# EAGLE design SmartSwitchController (EAGLE 6.4)
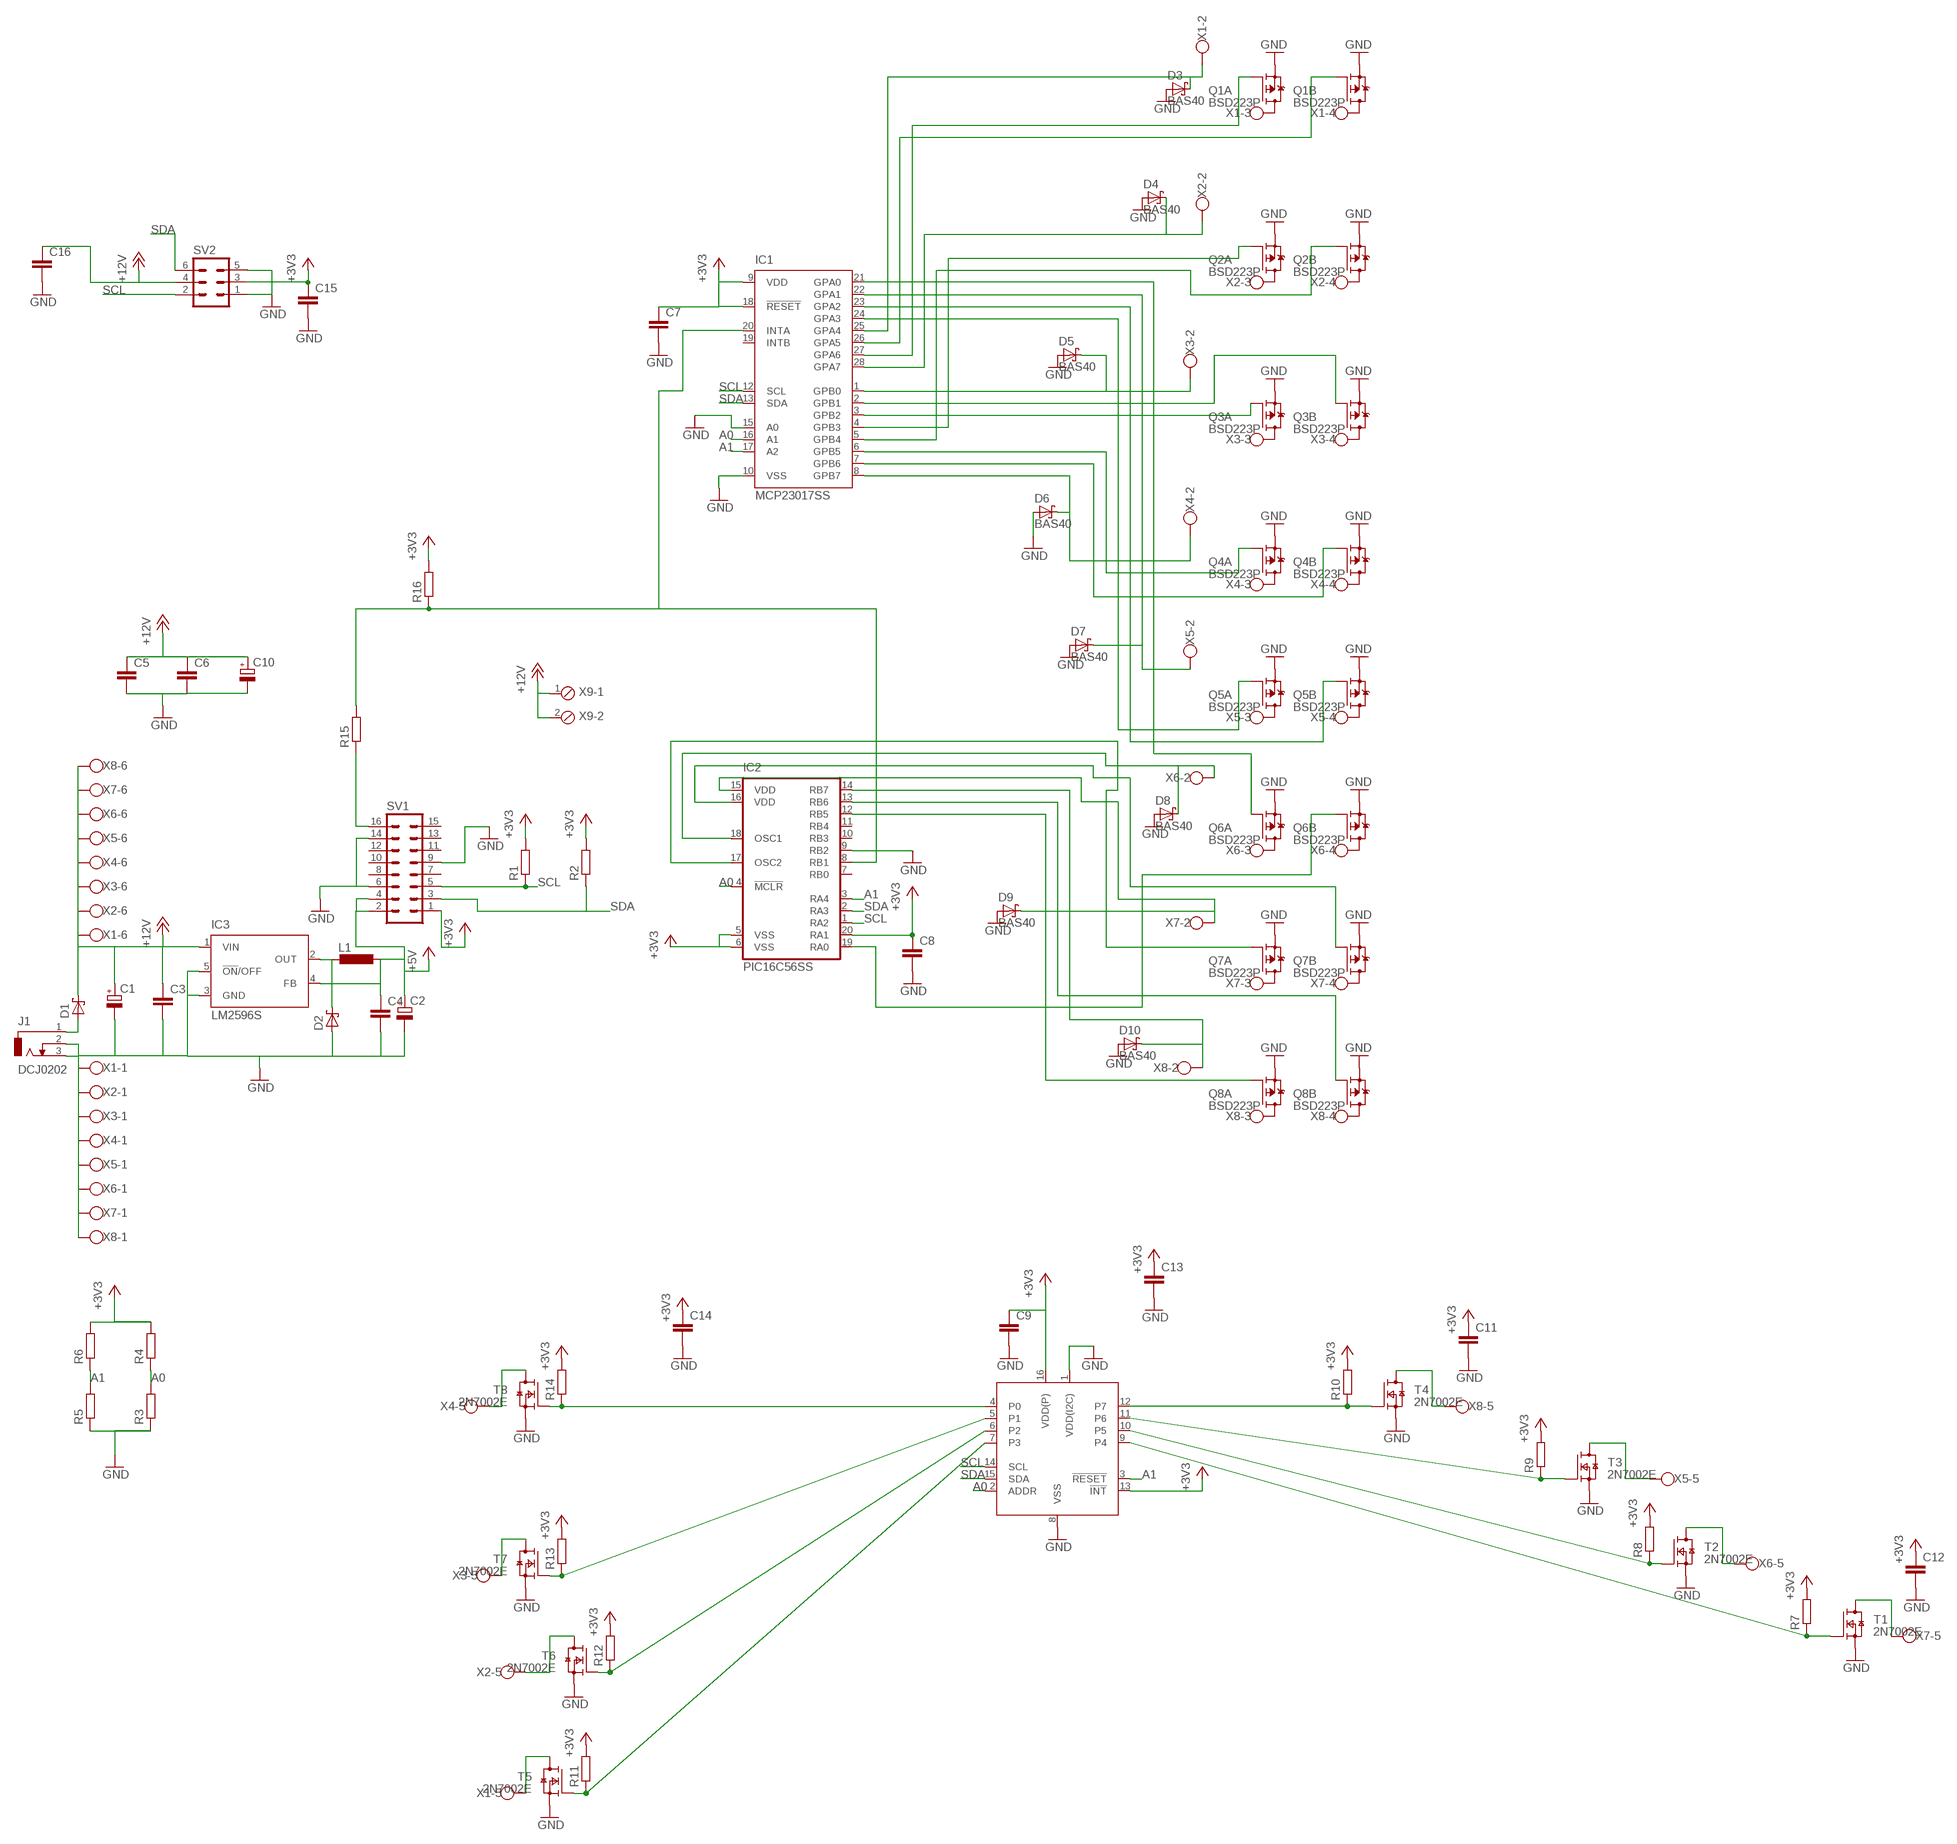
[diagram p0: schematic, sheet 1]

## Parts
C1  CPOL-EUUD-6,3X7,7  [UD-6,3X7,7_NICHICON]
C2  CPOL-EUUD-10X10  [UD-10X10_NICHICON]
C3  C-EUC0603  [C0603]
C4  C-EUC0603  [C0603]
C5  C-EUC0603  [C0603]
C6  C-EUC0805  [C0805]
C7  C-EUC0603  [C0603]
C8  C-EUC0603  [C0603]
C9  C-EUC0603  [C0603]
C10  CPOL-EUUD-6,3X7,7  [UD-6,3X7,7_NICHICON]
C11  C-EUC0603  [C0603]
C12  C-EUC0603  [C0603]
C13  C-EUC0805  [C0805]
C14  C-EUC0805  [C0805]
C15  C-EUC0805  [C0805]
C16  C-EUC0805  [C0805]
D1  SCHOTTKY-DIODESMC  [SMC]
D2  SCHOTTKY-DIODESMC  [SMC]
D3  BAS40  [SOT23]
D4  BAS40  [SOT23]
D5  BAS40  [SOT23]
D6  BAS40  [SOT23]
D7  BAS40  [SOT23]
D8  BAS40  [SOT23]
D9  BAS40  [SOT23]
D10  BAS40  [SOT23]
IC1  MCP23017SS  [SSOP28]
IC2  PIC16C56SS  [SSOP20]
IC3  LM2596S  [TO263-5]
J1  DCJ0202  [DCJ0202]
L1  L-EUL5650M  [L5650M]
Q1  BSD223P  [SOT363_INFINEON]
Q2  BSD223P  [SOT363_INFINEON]
Q3  BSD223P  [SOT363_INFINEON]
Q4  BSD223P  [SOT363_INFINEON]
Q5  BSD223P  [SOT363_INFINEON]
Q6  BSD223P  [SOT363_INFINEON]
Q7  BSD223P  [SOT363_INFINEON]
Q8  BSD223P  [SOT363_INFINEON]
R1  R-EU_R0603  [R0603]
R2  R-EU_R0603  [R0603]
R3  R-EU_R0402  [R0402]
R4  R-EU_R0402  [R0402]
R5  R-EU_R0402  [R0402]
R6  R-EU_R0402  [R0402]
R7  R-EU_R0402  [R0402]
R8  R-EU_R0402  [R0402]
R9  R-EU_R0402  [R0402]
R10  R-EU_R0402  [R0402]
R11  R-EU_R0402  [R0402]
R12  R-EU_R0402  [R0402]
R13  R-EU_R0402  [R0402]
R14  R-EU_R0402  [R0402]
R15  R-EU_R0603  [R0603]
R16  R-EU_R0603  [R0603]
SV1  MA08-2  [MA08-2]
SV2  MA03-2  [MA03-2]
T1  2N7002E  [SOT23]
T2  2N7002E  [SOT23]
T3  2N7002E  [SOT23]
T4  2N7002E  [SOT23]
T5  2N7002E  [SOT23]
T6  2N7002E  [SOT23]
T7  2N7002E  [SOT23]
T8  2N7002E  [SOT23]
U1  PCAL6408APW  [SOT403-1]
X1  W237-6  [W237-6]
X2  W237-6  [W237-6]
X3  W237-6  [W237-6]
X4  W237-6  [W237-6]
X5  W237-6  [W237-6]
X6  W237-6  [W237-6]
X7  W237-6  [W237-6]
X8  W237-6  [W237-6]
X9  MPT2  [2POL254]

## Nets
+3V3: C7.1 C8.1 C9.1 C11.1 C12.1 C13.1 C14.1 C15.1 IC1.9(VDD) IC1.18(!RESET) IC2.5(VSS) IC2.6(VSS) IC2.20(RA1) R1.2 R2.2 R4.2 R6.2 R7.2 R8.2 R9.2 R10.2 R11.2 R12.2 R13.2 R14.2 R16.2 SV1.1 SV2.3 U1.13(!INT!) U1.16(VDD(P))
+5V: C2.+ C4.1 IC3.4(FB) L1.1 SV1.2 SV1.4
+12V: C1.+ C3.1 C5.1 C6.1 C10.+ C16.1 D1.C IC3.1(VIN) SV2.4 X1.6 X2.6 X3.6 X4.6 X5.6 X6.6 X7.6 X8.6 X9.1 X9.2
A0: IC1.16(A1) IC2.4(!MCLR) R3.2 R4.1 U1.2(ADDR)
A1: IC1.17(A2) IC2.3(RA4) R5.2 R6.1 U1.3(!RESET!)
GND: C1.- C2.- C3.2 C4.2 C5.2 C6.2 C7.2 C8.2 C9.2 C10.- C11.2 C12.2 C13.2 C14.2 C15.2 C16.2 D2.A D3.1(A) D4.1(A) D5.1(A) D6.1(A) D7.1(A) D8.1(A) D9.1(A) D10.1(A) IC1.10(VSS) IC1.15(A0) IC2.9(RB2) IC3.3(GND) IC3.5(!ON!/OFF) J1.2 J1.3 Q1.1(A:S) Q1.4(B:S) Q2.1(A:S) Q2.4(B:S) Q3.1(A:S) Q3.4(B:S) Q4.1(A:S) Q4.4(B:S) Q5.1(A:S) Q5.4(B:S) Q6.1(A:S) Q6.4(B:S) Q7.1(A:S) Q7.4(B:S) Q8.1(A:S) Q8.4(B:S) R3.1 R5.1 SV1.6 SV1.9 SV1.14 SV2.1 SV2.5 T1.2(S) T2.2(S) T3.2(S) T4.2(S) T5.2(S) T6.2(S) T7.2(S) T8.2(S) U1.1(VDD(I2C)) U1.8(VSS) X1.1 X2.1 X3.1 X4.1 X5.1 X6.1 X7.1 X8.1
N$1: Q2.3(B:D) X2.4
N$2: Q3.6(A:D) X3.3
N$3: D1.A J1.1
N$4: Q1.6(A:D) X1.3
N$6: Q1.3(B:D) X1.4
N$7: Q3.3(B:D) X3.4
N$8: Q2.6(A:D) X2.3
N$9: Q4.6(A:D) X4.3
N$10: D2.C IC3.2(OUT) L1.2
N$11: Q4.3(B:D) X4.4
N$12: Q5.3(B:D) X5.4
N$13: Q5.6(A:D) X5.3
N$14: Q6.6(A:D) X6.3
N$15: Q6.3(B:D) X6.4
N$16: Q7.6(A:D) X7.3
N$17: Q7.3(B:D) X7.4
N$18: Q8.6(A:D) X8.3
N$19: Q8.3(B:D) X8.4
N$20: IC1.21(GPA0) Q6.2(A:G)
N$21: D7.3(C) IC1.22(GPA1) X5.2
N$22: IC1.23(GPA2) Q5.5(B:G)
N$23: IC1.24(GPA3) Q5.2(A:G)
N$24: D3.3(C) IC1.25(GPA4) X1.2
N$25: IC1.26(GPA5) Q1.5(B:G)
N$26: IC1.27(GPA6) Q1.2(A:G)
N$27: D4.3(C) IC1.28(GPA7) X2.2
N$28: IC1.5(GPB4) Q2.5(B:G)
N$29: IC1.4(GPB3) Q2.2(A:G)
N$30: D5.3(C) IC1.1(GPB0) X3.2
N$31: IC1.2(GPB1) Q3.5(B:G)
N$32: IC1.3(GPB2) Q3.2(A:G)
N$33: IC1.6(GPB5) Q4.2(A:G)
N$34: IC1.7(GPB6) Q4.5(B:G)
N$35: D6.3(C) IC1.8(GPB7) X4.2
N$36: D9.3(C) IC2.15(VDD) X7.2
N$37: IC2.16(VDD) Q7.5(B:G)
N$38: IC2.17(OSC2) Q7.2(A:G)
N$39: D8.3(C) IC2.18(OSC1) X6.2
N$40: IC2.19(RA0) Q6.5(B:G)
N$41: D10.3(C) IC2.14(RB7) X8.2
N$42: IC2.13(RB6) Q8.5(B:G)
N$43: IC2.12(RB5) Q8.2(A:G)
N$46: R11.1 T5.1(G) U1.7(P3)
N$47: R12.1 T6.1(G) U1.6(P2)
N$48: R13.1 T7.1(G) U1.5(P1)
N$49: R14.1 T8.1(G) U1.4(P0)
N$50: R7.1 T1.1(G) U1.9(P4)
N$51: R8.1 T2.1(G) U1.10(P5)
N$52: R9.1 T3.1(G) U1.11(P6)
N$53: R10.1 T4.1(G) U1.12(P7)
N$56: IC1.20(INTA) IC2.8(RB1) R15.2 R16.1
N$61: T1.3(D) X7.5
N$62: T2.3(D) X6.5
N$63: T3.3(D) X5.5
N$65: T4.3(D) X8.5
N$66: T5.3(D) X1.5
N$67: T6.3(D) X2.5
N$69: T7.3(D) X3.5
N$70: T8.3(D) X4.5
N$72: R15.1 SV1.16
SCL: IC1.12(SCL) IC2.1(RA2) R1.1 SV1.5 SV2.2 U1.14(SCL)
SDA: IC1.13(SDA) IC2.2(RA3) R2.1 SV1.3 SV2.6 U1.15(SDA)
Unconnected: IC1.19(INTB) IC2.7(RB0) IC2.10(RB3) IC2.11(RB4) SV1.7 SV1.8 SV1.10 SV1.11 SV1.12 SV1.13 SV1.15

## Library data of the parts
C1 C2 C10 = billyInd:CPOL-EU: POLARIZED CAPACITOR, European symbol
C3-C9 C11-C16 = billyInd:C-EU: CAPACITOR, European symbol
D1 D2 = diodebilly:SCHOTTKY-DIODE: Schottky Diode
D3-D10 = diodebilly:BAS40: Silicon Schottky Diodes General-purpose diode for high-speed switching
IC1 = microchip:MCP23017: http://ww1.microchip.com/downloads/en/DeviceDoc/21952a.pdf Source: http://ww1.microchip.com/downloads/en/DeviceDoc/21952a.pdf; MF: MICROCHIP; MPN: MCP23017-E/SS; OC_FARNELL: 1467674; OC_NEWARK: 31K2960
IC2 = microchip:PIC16C56*SS: MICROCONTROLLER EPROM/ROM-based; MF: MICROCHIP; MPN: PIC16C56A-04/SS; OC_FARNELL: 116506; OC_NEWARK: 23C3557
IC3 = national-semiconductor:LM2596: SIMPLE SWITCHER® Power Converter 150 kHz 3A Step-Down Voltage Regulator Source: http://www.national.com/ds/LM/LM2596.pdf; MF: NATIONAL SEMICONDUCTOR; MPN: LM2596S-ADJ/NOPB; OC_FARNELL: 9494367; OC_NEWARK: 41K3842
J1 = con-jack:DCJ0202: DC POWER JACK Source: DCJ0202.pdf; OC_FARNELL: unknown; OC_NEWARK: unknown
L1 = billyInd:L-EU: INDUCTOR, European symbol
Q1-Q8 = transistor-fet:BSD223P: OptiMOS(R)-P Small-Signal-Transistor Dual P-Channel, Enhancement mode, Super Logic Level (2.5 V rated) Source: http://www.infineon.com/upload/Document/BSD223P_Rev1.3.pdf
R1-R16 = billyInd:R-EU_: RESISTOR, European symbol
SV1 = con-lstb:MA08-2: PIN HEADER; OC_FARNELL: unknown; OC_NEWARK: unknown
SV2 = con-lstb:MA03-2: PIN HEADER; OC_FARNELL: unknown; OC_NEWARK: unknown
T1-T8 = NXP_60_26022015:2N7002: N-channel TrenchMOS FET N-channel enhancement mode Field-Effect Transistor (FET) in a plastic package using TrenchMOS technology. AAL Eindhoven MK
U1 = NXP_60_26022015:PCAL6408A: Low-voltage translating, 8-bit I2C-bus/SMBus I/O expander with interrupt output, reset, and configuration registers The PCAL6408A is an 8-bit general purpose I/O expander that provides remote I/O expansion for most microcontroller families via the I2C-bus interface. AAL Eindhoven MK
X1-X8 = strip_connector_billy:W237-6: WAGO SCREW CLAMP; OC_FARNELL: unknown; OC_NEWARK: unknown
X9 = con-phoenix-254:MPT2: PHOENIX CONNECTOR; OC_FARNELL: unknown; OC_NEWARK: unknown

## Board
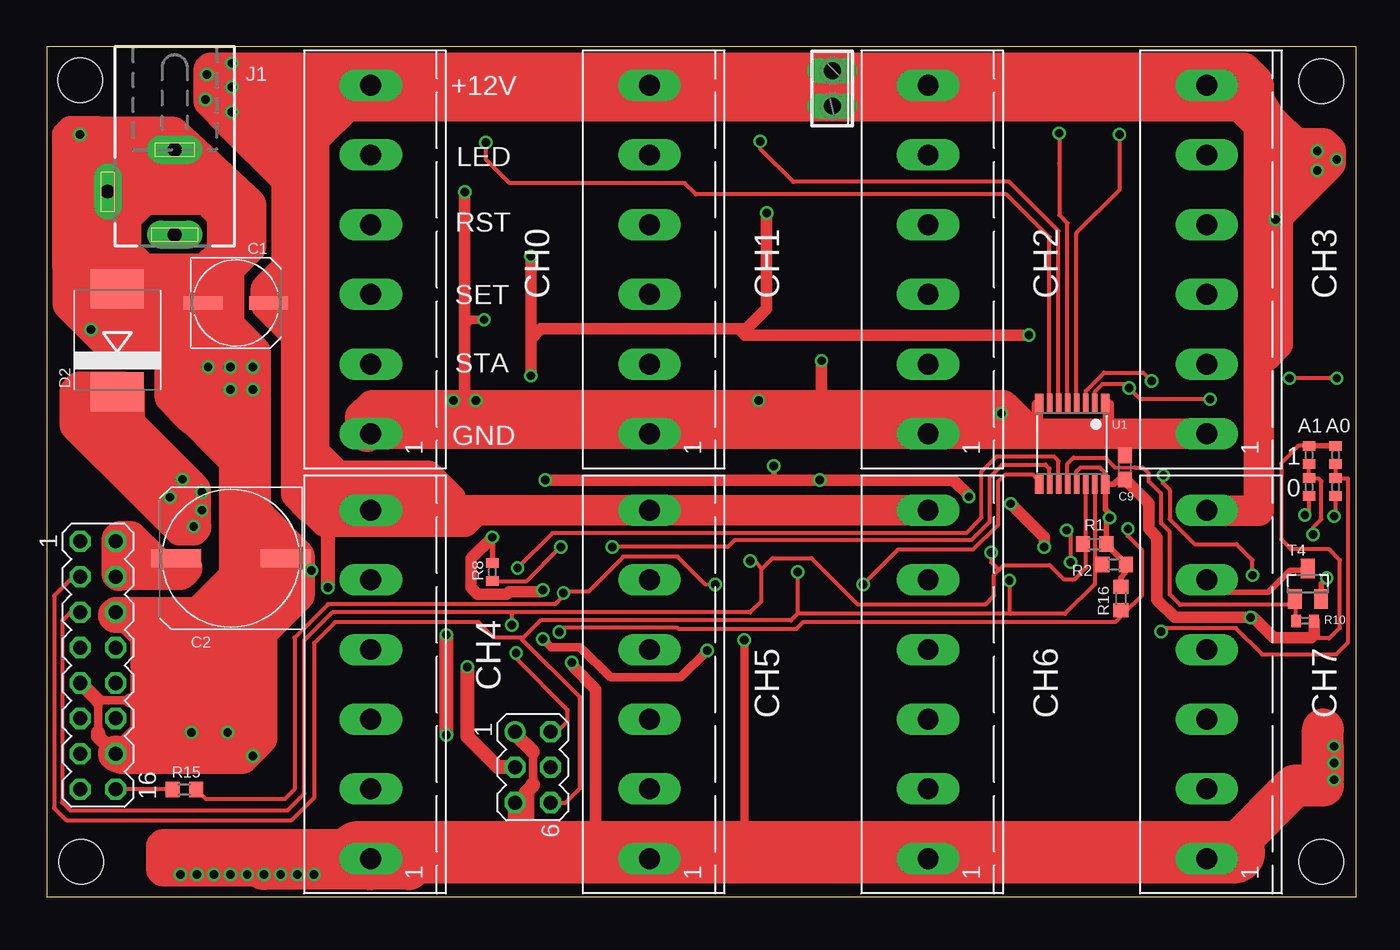
[diagram p1: board, top side]
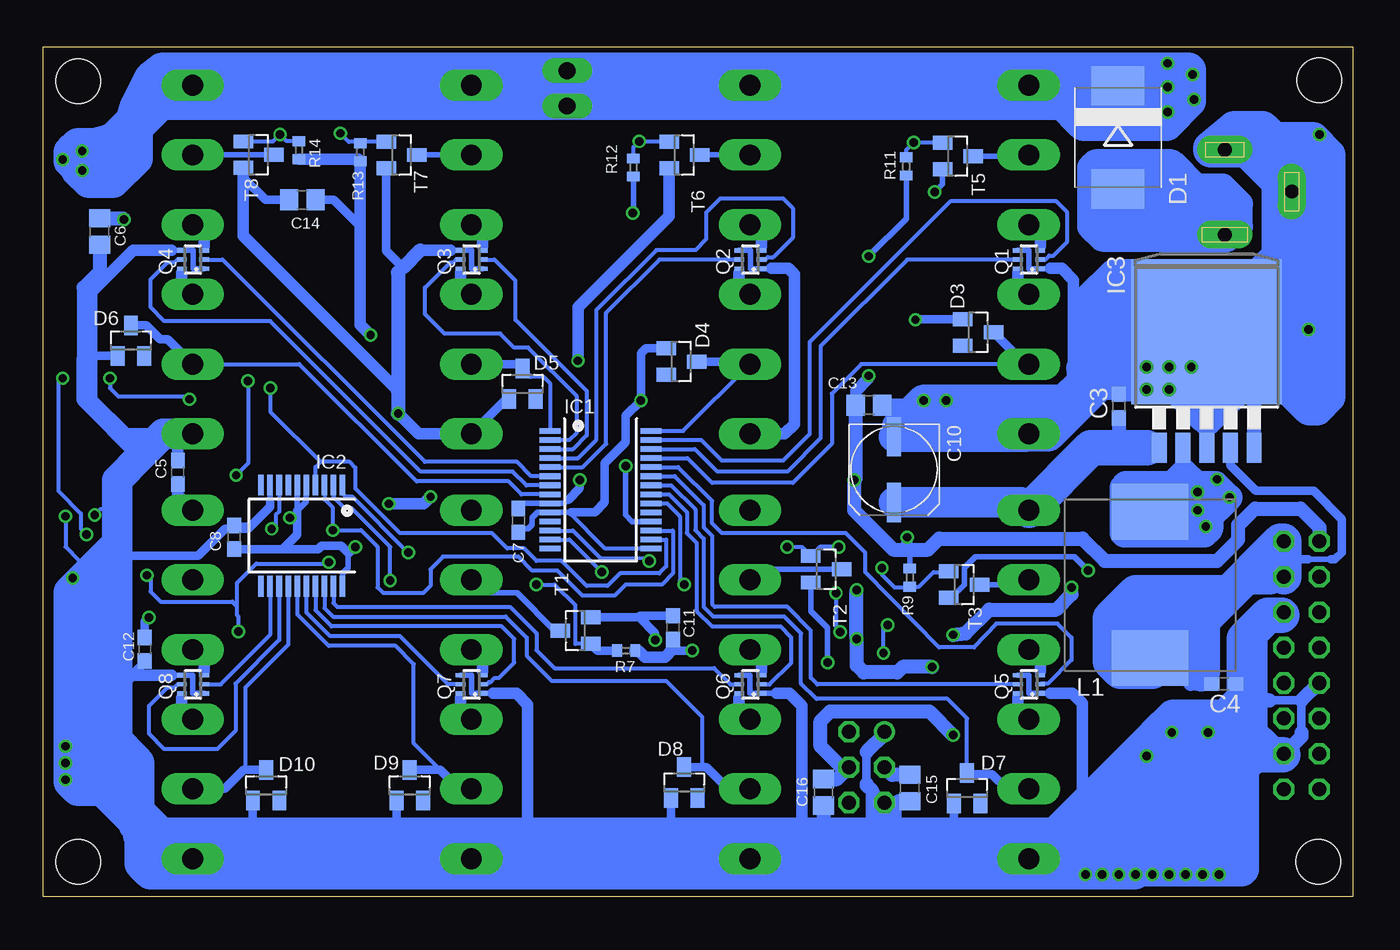
[diagram p2: board, bottom side, seen from below]

Size 94 x 61 mm. Coordinates in mm from the lower left corner, seen from the top.
Outline: 0,0 94,0 94,61 0,61 0,0
Copper layers (1*16): Top 0.0356mm / dielectric 1.5011mm / Bottom 0.0356mm
Design rules "LaenPCBOrder *": minimum track width 6mil, minimum drill 13mil, track to track 6mil, track to pad 6mil, pad to pad 6mil, via to via 6mil, smd to smd 6mil, copper to edge 15mil, drill to drill 6mil, minimum pad ring 7mil, minimum via ring 7mil, stop-mask expansion 4mil, vias tented up to drill 24mil, thermal gap 10mil
Holes 3.2 mm at 2.5,2.5 2.4,58.6 91.5,58.5 91.5,2.5

### Footprints (pad centres in the part's own frame; a part is rotated, then mirrored left to right if it is on the bottom)
UD-6,3X7,7_NICHICON = smd 2.8 x 1: + 2.35,0; - -2.35,0
UD-10X10_NICHICON = smd 3.6 x 1.3: + 3.925,0; - -3.95,0
C0603 = smd 1.1 x 1: 1 -0.85,0; 2 0.85,0
C0805 = smd 1.3 x 1.5: 1 -0.95,0; 2 0.95,0
SMC = smd 2.8 x 3.8: A 3.7,0; C -3.7,0
SOT23 = smd 1 x 1.4: 1 -0.95,-1.1; 2 0.95,-1.1; 3 0,1.1
SSOP28 = smd 0.4 x 1.5: 1 -4.225,-3.625; 2 -3.575,-3.625; 3 -2.925,-3.625; 4 -2.275,-3.625; 5 -1.625,-3.625; 6 -0.975,-3.625; 7 -0.325,-3.625; 8 0.325,-3.625; 9 0.975,-3.625; 10 1.625,-3.625; 11 2.275,-3.625; 12 2.925,-3.625; 13 3.575,-3.625; 14 4.225,-3.625; 15 4.225,3.625; 16 3.575,3.625; 17 2.925,3.625; 18 2.275,3.625; 19 1.625,3.625; 20 0.975,3.625; 21 0.325,3.625; 22 -0.325,3.625; 23 -0.975,3.625; 24 -1.625,3.625; 25 -2.275,3.625; 26 -2.925,3.625; 27 -3.575,3.625; 28 -4.225,3.625
SSOP20 = smd 0.4 x 1.5: 1 -2.925,-3.625; 2 -2.275,-3.625; 3 -1.625,-3.625; 4 -0.975,-3.625; 5 -0.325,-3.625; 6 0.325,-3.625; 7 0.975,-3.625; 8 1.625,-3.625; 9 2.275,-3.625; 10 2.925,-3.625; 11 2.925,3.625; 12 2.275,3.625; 13 1.625,3.625; 14 0.975,3.625; 15 0.325,3.625; 16 -0.325,3.625; 17 -0.975,3.625; 18 -1.625,3.625; 19 -2.275,3.625; 20 -2.925,3.625
TO263-5 = smd 1.067 x 2.159: 1 -3.404,-5.791; 2 -1.702,-5.791; 3 0,-5.791; 4 1.702,-5.791; 5 3.404,-5.791 | smd 10.8 x 10.41: 6 0,2.54
DCJ0202 = drill 1 pad 2 long: 1 0,3.1; 2 4.8,0; 3 0,-3
L5650M = smd 4 x 5.5: 1 -5.25,0; 2 5.25,0
SOT363_INFINEON = smd 0.3 x 0.7: 1 -0.65,-0.8; 2 0,-0.8; 3 0.65,-0.8; 4 0.65,0.8; 5 0,0.8; 6 -0.65,0.8
R0603 = smd 1 x 1.1: 1 -0.85,0; 2 0.85,0
R0402 = smd 0.7 x 0.9: 1 -0.65,0; 2 0.65,0
MA08-2 = drill 1.016 octagon: 1 -8.89,-1.27; 2 -8.89,1.27; 3 -6.35,-1.27; 4 -6.35,1.27; 5 -3.81,-1.27; 6 -3.81,1.27; 7 -1.27,-1.27; 8 -1.27,1.27; 9 1.27,-1.27; 10 1.27,1.27; 11 3.81,-1.27; 12 3.81,1.27; 13 6.35,-1.27; 14 6.35,1.27; 15 8.89,-1.27; 16 8.89,1.27
MA03-2 = drill 1.016: 1 -2.54,-1.27 | drill 1.016 octagon: 2 -2.54,1.27; 3 0,-1.27; 4 0,1.27; 5 2.54,-1.27; 6 2.54,1.27
SOT403-1 = smd 0.6 x 1.35: 1 -2.375,-2.925; 8 2.375,-2.925; 9 2.375,2.925; 16 -2.375,2.925 | smd 0.4 x 1.35: 2 -1.625,-2.925; 3 -0.975,-2.925; 4 -0.325,-2.925; 5 0.325,-2.925; 6 0.975,-2.925; 7 1.625,-2.925; 10 1.625,2.925; 11 0.975,2.925; 12 0.325,2.925; 13 -0.325,2.925; 14 -0.975,2.925; 15 -1.625,2.925
W237-6 = drill 1.5 long: 1 -12.5,-1.27; 2 -7.5,-1.27; 3 -2.5,-1.27; 4 2.5,-1.27; 5 7.5,-1.27; 6 12.5,-1.27
2POL254 = drill 1.2 long: 1 -1.27,0; 2 1.27,0

### Placement (x,y rotation side)
C1  13.6,42.6 0 top
C2  13.23,24.29 180 top
C3  16.8,35.2 90 bottom
C4  9.28,15.27 0 bottom
C5  84.33,30.46 90 bottom
C6  89.95,47.72 270 bottom
C7  59.9,27 270 bottom
C8  80.3,25.8 90 bottom
C9  77.4,30.8 90 top
C10  32.94,30.64 270 bottom
C11  48.8,19.32 90 bottom
C12  86.7,17.76 270 bottom
C13  34.74,35.28 0 bottom
C14  75.4,50 180 bottom
C15  31.8,7.8 270 bottom
C16  38,7.5 270 bottom
D1  16.86,54.48 270 bottom
D2  5.08,39.94 90 top
D3  26.9,40.5 270 bottom
D4  48.2,38.4 270 bottom
D5  59.6,36.8 0 bottom
D6  87.7,39.9 0 bottom
D7  27.7,7.8 0 bottom
D8  48,8.2 0 bottom
D9  67.7,8 0 bottom
D10  78,8 0 bottom
IC1  54,29.2 270 bottom
IC2  75.44,25.92 180 bottom
IC3  10.5,38 0 bottom
J1  9.2,50.6 180 top
L1  14.55,22.38 90 bottom
Q1  23.25,45.72 90 bottom
Q2  43.25,45.72 90 bottom
Q3  63.25,45.72 90 bottom
Q4  83.25,45.72 90 bottom
Q5  23.25,15.24 90 bottom
Q6  43.25,15.24 90 bottom
Q7  63.25,15.24 90 bottom
Q8  83.25,15.24 90 bottom
R1  75.22,25.3 0 top
R2  76.61,23.84 0 top
R3  90.6,29.4 90 top
R4  90.6,31.7 90 top
R5  92.5,29.4 90 top
R6  92.5,31.7 90 top
R7  52.16,17.66 0 bottom
R8  32,23.3 90 top
R9  31.8,22.9 90 bottom
R10  90.32,19.8 0 top
R11  32.06,52.4 270 bottom
R12  51.64,52.32 270 bottom
R13  71.24,53.42 270 bottom
R14  75.64,53.56 270 bottom
R15  9.9,7.7 0 top
R16  77.1,21.4 90 top
SV1  3.69,16.61 270 top
SV2  34.9,9.3 270 top
T1  55.8,19.1 90 bottom
T2  37.8,23.5 270 bottom
T3  27.9,22.4 270 bottom
T4  90.52,22.46 0 top
T5  28.36,53.14 270 bottom
T6  47.98,53.22 270 bottom
T7  68.28,53.22 270 bottom
T8  78.54,53.24 270 bottom
U1  73.6,32.5 180 top
X1  22,45.72 90 top
X2  42,45.72 90 top
X3  62,45.72 90 top
X4  82,45.72 90 top
X5  22,15.24 90 top
X6  42,15.24 90 top
X7  62,15.24 90 top
X8  82,15.24 90 top
X9  56.4,58 270 top

### Tracks (layer width: path | path; a pad name or v marks a point on that pad's centre or on a via)
+3V3  (via drill 0.6)
  Top 0.305: U1.16 75.97,30.43 75.6,30.8 74.2,30.8 73.92,30.52 U1.13 | R4.2 89.85,32.35 88.6,31.1 88.6,25.64 89.32,24.92 92.06,24.92 92.82,24.16 92.82,19.3 92.06,18.54 90.53,18.54 90.5,18.57 | 86.6,20.04 86.7,20.04 88.2,18.54
  Top 0.406: C9.1 76.95,29.95 76.6,29.6 76,29.6 U1.16 76,29.55 76,27.8 76.3,27.5 v76.3,27.2 76.07,26.97 R1.2 77.46,23.91 R2.2 77.4,23.78 77.4,23.2 77.1,22.9 R16.2 | v52.2,30.9 52.2,30.1 52,29.9 | R4.2 R6.2 | R8.2 v32,25.8
  Top 0.61: v66.2,28.7 66.2,28.8 | v47.42,17.66 45.5,15.74 40.46,15.74 38.3,17.9 36.22,17.9 v35.62,18.5 35.66,18.46 | 35.5,21.9 v35.62,22.02
  Top 0.813: v35.8,29.9 52,29.9 v55.5,29.9 65.1,29.9 66.2,28.8 | v71.6,25.1 71.6,25.8 v69.2,28.2 | v32,25.8 30.48,24.28 30.48,22.16 30.92,21.72 33.02,21.72 33.2,21.9 35.5,21.9 | R10.2 90.98,18.78 90.77,18.57 90.5,18.57 88.07,18.57 86.6,20.04 v86.42,20.04 80.96,20.04 79.7,21.3 79.7,25.8 79.1,26.4 79.1,28.25 C9.1 | v34.76,45.96 34.76,40.04 | 34.76,40.04 v34.76,37.38 | v51.68,49.06 51.68,42.2 50.22,40.74 49.7,40.74 | 49.7,40.74 35.46,40.74 34.76,40.04 | v70.5,40.3 50.14,40.3 49.7,40.74
  Top 1.016: SV2.3 32.4,9.3 30.2,11.5 v30.2,16.5
  Bottom 0.406: IC2.6 75.77,27.7 75.11,28.35 IC2.5 75.11,28.48 | C7.1 59.52,28.23 IC1.9 56.58,28.23 56.3,28.5 | 72.1,24.7 72.1,23.6 72.5,23.2 72.5,22.31 IC2.20 | IC1.18 51.73,26.93 52.2,27.4 v52.2,30.9 | R9.2 31.8,24.91 | 32,25.11 32.2,24.91 | R11.2 32.06,48.66 v34.76,45.96 | R12.2 51.64,49.1 v51.68,49.06
  Bottom 0.61: C8.1 76.8,24.95 | 75.77,27.7 75.77,27 | 76.8,24.95 75.77,25.98 75.77,27 | 76.8,24.95 74.25,24.95 74,25.2 72.6,25.2 72.1,24.7 72,24.7 v71.6,25.1 | 56.3,28.5 55.5,29.3 v55.5,29.9 | v76.3,27.2 75.77,27 | v47.42,17.66 48.68,17.66 48.8,17.78 C11.1 | C12.1 86.7,19.76 v86.42,20.04 | C14.1 73.14,50 71.24,48.1
  Bottom 0.813: v69.2,28.2 66.7,28.2 v66.2,28.7 | v32,25.8 32,25.11 | v34.76,37.38 34.76,37.2 35.68,36.28 C13.1 | R14.2 71.38,52.91 R13.2 71.24,48.1 71.24,41.04 v70.5,40.3 | R7.2 51.26,17.66 50.8,17.2 49.38,17.2 48.8,17.78
  Bottom 1.016: SV1.1 2.4,25.52 2.4,26.5 3.75,27.85 7.04,27.85 8.23,26.66 8.23,25.62 9.74,24.11 17.82,24.11 19.41,25.7 29.7,25.7 30.49,24.91 31.8,24.91 32.2,24.91 32.98,24.91 35.8,27.73 v35.8,29.9 35.69,30.01 C13.1 | v35.62,22.02 v35.62,18.5 35.6,18.48 35.6,16.6 35.1,16.1 32.7,16.1 32.3,16.5 v30.2,16.5 | C15.1 33.08,8.75 SV2.3
+5V
  Top 0.813: SV1.4 7.97,22.96 C2.+
  Top 1.016: C2.+ 9.3,24.11 8.5,23.3
  Top 2.54: 6.9,23.3 8.5,23.3 9.6,23.3 9.9,23.6 | 6.9,23.3 5.3,23.3 | 7.8,23.5 6.7,23.5 | 6.7,23.5 5.5,23.5 5.2,23.2 5.2,25.6 5.3,25.7 6,25.7 7.5,24.2 | 6.7,23.5 6.9,23.3
  Bottom 0.406: 1.6,24.2 3.2,24.2 | 7.68,22.95 7.8,22.95 7.8,22.96 SV1.4
  Bottom 0.61: IC3.4 8.8,30.96 6.96,29.12 2.82,29.12 0.8,27.1 0.8,24.7 1.3,24.2 1.6,24.2 | 3.2,24.2 4.7,24.2 4.9,24 4.9,23.02 SV1.4
  Bottom 1.016: C4.1 11.64,15.27 13.5,17.13
  Bottom 2.54: L1.1 13.5,17.13 11.56,19.07 | 11.56,19.07 11.41,19.21 | 11.41,19.21 7.68,22.95 5.97,22.95 | SV1.2 SV1.4 | 5,25.5 5.2,25.5 9.3,21.4 9.3,21.5 9,21.8 15.6,21.8 17.4,20 17.4,16.9 16.7,16.2 14.4,16.2 11.45,19.15 | 11.45,19.15 10.7,19.9 10.8,19.9 10.8,16.1 10.9,16 | 15.5,19.5 15.4,19.6 11.41,19.6 11.41,19.21 | 11.56,19.07 11.45,19.07 11.45,19.15
+12V  (via drill 0.6)
  Top 0.254: 14.6,55.5 13.4,55.5 13.3,55.5 13.3,59 | 14.6,55.5 14.6,54.9 14.75,54.9 14.75,55.05 | 14.6,55.5 16.86,55.5 D1.C
  Top 0.406: 21.4,56.8 21.7,56.8 21.7,56.9 | 91.6,53.8 92,53.8 92,53.1 | 92,53.9 91.5,53.9 91.2,53.9 v91.2,53.5 | 92,53.9 92,53 | 92,53.9 92.6,53.9 v92.6,52.9
  Top 0.61: 91.6,53.9 91.6,53.8 | 89.6,53.8 89.6,53.9 | 91.4,53.9 91.2,53.9 91.2,53.7
  Top 0.813: 18.4,42.6 19.1,42.6 19.2,42.7 | 20.2,27.64 20.3,27.74
  Top 1.016: 83.99,27.93 83.76,27.7 | v13.3,59.8 13.3,59.3 13.3,59 | v11.5,59 13.3,59 | 13.3,59 v13.3,58.1 | v13.3,56.3 13.25,56.3 13.25,55.65 | v11.4,57.2 11.8,57.2 | 87,58.22 83.6,58.22 83.6,58.02 84.2,58.02 84.2,56.73 87.77,56.63 v91.2,53.5 | 85.7,56.9 87.3,55.6 v91.2,52.1 | v88.2,48.6 88.1,42.5 87.5,41.9 | v28.7,11.6 v28.7,18.8 | v20.2,22.2 20.2,27.64
  Top 2.184: X1.6 X2.6 X3.6 X4.6 | X1.6 87,58.22 87,27.7 83.76,27.7 83.27,27.7 X8.6 | X7.6 X6.6 X5.6 20.3,27.74 19.2,27.74 19.2,42.7 19.2,58.2 23.27,58.2 X1.6
  Top 2.54: C1.+ 18.4,42.6 | 17.6,55.4 17.9,55.7 17.9,57.5 17.8,57.4 13.7,57.4 17.9,53.2 18.4,53.2 18.2,53 16.8,53 14.75,55.05 14.3,55.5 13.4,55.5 13.25,55.65 11.8,57.1 11.8,57.2 11.8,59.3 13.3,59.3 85.5,59.3 | 85.5,59.3 87.4,56.2 v88.2,48.6 | v88.2,48.6 88.2,39.7 87.5,39 | 87.5,39 87.5,39.9 | 87.5,39.9 87.5,41.9 87.5,55.1 85.7,56.9 21.7,56.9 18.8,56.9 18.7,57 | 18.8,54.8 19.4,54.8 21.4,56.8 | 87.5,39.9 87.2,39.5 87.5,39 | v88.2,48.6 88.2,48.9 92,52.7 92,53 92,53.1 92,53.5 91.6,53.9 91.5,53.9 91.4,53.9 | 91.4,53.9 89.6,53.9 89.5,53.9 87.5,55.9 87.5,56 86.8,56.7 86.8,58.4 85.9,59.3 85.5,59.3 | 86.7,57 87.1,56.6 87.8,53.6 90.2,52 91.4,53.9 | 91.4,53.9 91.6,53.8 91.3,53.7 91.2,53.7 89.6,53.7 | 90.1,53.8 89.6,53.8 88.4,52.6
  Bottom 0.406: D1.C 16.9,58.18 16.9,58.8 | 21.25,56.9 23.2,56.9 23.2,58.2 19.3,58.2 19.3,55.4 19.1,55.4 19.1,55.5 | 20.9,56.9 21.25,56.9 | 21.25,56.9 21.25,56.65 23.2,56.65 23.2,58.3 | v92.6,52.9 92.5,52.9 92.5,53 92,53 | X9.1 X9.2 49.6,56.33 49.6,58.02 | 20.1,59.3 25.6,59.3 25.6,59.6
  Bottom 0.813: IC3.1 14.79,32.21 14.8,32.2 | C5.1 84.33,28.8 X8.6 | SV2.4 36.7,9.3
  Bottom 1.016: C3.1 16.8,32.4 16.6,32.2 | v91.2,53.5 88.32,53.6 84,58.02 | v91.2,52.1 86.62,55.3 83.9,58.02 | C6.1 88.27,48.67 v88.2,48.6 | C16.1 37.02,8.45 SV2.4 | 36.7,9.3 38.2,10.8 38.2,12.6 37.5,13.3 30.4,13.3 v28.7,11.6 | v28.7,18.8 27.8,18.9 26.1,20.6 21.3,20.6 20.2,21.7 v20.2,22.2
  Bottom 1.93: 15.17,59.28 15.21,59.28 | 22.64,59.58 85.57,59.58 86.46,58.89 86.46,57.52 85.67,56.73 15.22,56.73 14.84,57.11 14.84,59.31 15.21,59.28 | 15.21,59.28 22.64,59.58 | 22.64,59.58 24.4,58.02 49.6,58.02 83.9,58.02 84,58.02 85.46,58.02 85.67,58.23
  Bottom 2.184: C10.+ 23.82,28.29 X5.6
  Bottom 2.54: 14.8,32.2 16.6,32.2 18.81,32.2 X5.6 | D1.C 23.23,58.18 X1.6 | 20.1,57.4 20.1,56.3 | 20.1,56.3 19.3,55.5 19.1,55.5 13.4,55.5 11.8,57.1 11.8,59.3 20.1,59.3 | 21.5,57.5 21.3,57.5 20.1,56.3 | 20.1,59.3 20.5,59.3 | 20.5,59.3 21.1,58.8 19.6,58.8 | 13.9,57.4 15.3,58.8 16.9,58.8 19.6,58.8 | 20.9,56.9 20.7,56.9 19.4,55.6 | 85.4,58.7 86.2,58.7 87.2,56.7 87.6,55.4 89.1,54.2 91,53.7 91.6,53.7 91.5,52.3 91.2,52 89.4,53.2 87.4,55.2 | 87.4,55.2 85.1,57.5 84.6,57.5 | 87.4,55.2 87.4,53 89,51.4 90.7,51.4 91.4,52.1 91.4,52.2 92,52.8 92,53 92,53.4 91.5,53.9 89.3,53.9 87.4,55.8 | 19.6,58.8 20.1,59.3 | 20.5,59.3 25.7,59.3
A0  (via drill 0.6)
  Top 0.305: U1.2 75.22,36.23 75.8,36.8 77.4,36.8 v77.7,36.5 78.5,35.7 v83.5,35.7 | R4.1 R3.2 90.65,30 91.3,30 91.5,29.8 91.5,27.1 90.9,26.5 v90.9,26 | v92.6,37.2 v89.2,37.2
  Bottom 0.305: IC1.16 49.3,25.62 49.3,23.7 49.8,23.2 52.6,23.2 53.5,22.3 55,22.3 56.8,24.1 58.6,24.1 59.5,25 60.7,25 61.8,26.1 68.4,26.1 71.6,29.3 71.6,30.8 72,31.2 74.1,31.2 | 74.1,31.2 74.47,30.84 IC2.4 | v77.7,36.5 77.7,34.8 74.1,31.2 | v92.6,37.2 92.9,36.9 92.9,29.1 91.3,27.5 91.3,26.4 v90.9,26 | v89.2,37.2 89.2,36.5 88.6,35.9 83.7,35.9 v83.5,35.7
A1  (via drill 0.6)
  Top 0.305: U1.3 74.58,36.27 75.9,37.6 78.7,37.6 v79.3,37 | v73.5,24 73.5,26 v73.2,26.3 | R6.1 R5.2 92.55,30 93.39,30 93.39,18.23 92.56,17.4 87.24,17.4 85.36,19.28 80.22,19.28 v79.98,19.04 | v86.55,23.07 86.55,24.15 85.4,25.3 82.4,25.3 80.6,27.1 80.6,29.2 80.1,29.7 80.1,30.19 v80.15,30.24
  Bottom 0.305: IC1.17 48.8,26.27 48.8,23.2 49.6,22.4 52.2,22.4 53,21.6 55.3,21.6 57.1,23.4 58.9,23.4 59.9,24.4 65.3,24.4 66.2,23.5 66.2,22.3 66.7,21.8 69.6,21.8 70,22.2 70,25.1 71.2,26.3 v73.2,26.3 73.2,27.9 73.81,28.52 IC2.3 | v79.3,37 79.3,31.09 v80.15,30.24 | v73.5,24 73.6,23.9 78.7,23.9 80.1,22.5 80.1,20.86 | v86.55,23.07 86.3,22.82 86.3,21.9 85.58,21.18 80.42,21.18 80.1,20.86 | v79.98,19.04 79.98,20.1 80.1,20.22 80.1,20.86
GND  (via drill 0.6)
  Top 0.254: v68.53,34.68 68.42,34.68 68.4,34.7
  Top 0.305: C9.2 77.4,33.22 | R3.1 90.6,27.7 v90.3,27.4 | R5.1 92.5,27.4 v92.4,27.3 | v3.2,40.7 4.36,42.3 3.98,42.68
  Top 0.406: U1.1 76.08,35.42 76.2,35.3 | v13.2,36.4 13.2,38.8 2.9,49.1 | v19,23.4 18.3,22.2 17.7,22.8 | 37.7,4.7 41.31,4.7 X6.1 | T4.2 91.47,22.47 v91.88,22.88 | 30.02,35.86 29.92,35.76 30.64,35.76 v30.8,35.6
  Top 0.61: U1.8 71.1,35.3 | v51.1,35.6 51.1,33.32 51.2,33.22 | 3.7,14.1 6,14.1 | v14.8,10.1 8.2,9.8 6.55,10.95 | 3.7,14 3.7,11.8 | 3.7,11.5 3.72,11.5 SV1.14 | 9.54,35.02 9.75,35.02 9.75,35.15 | 23.2,33.3 23.27,33.3 X1.1 | 12.45,46.31 12.9,46.31 12.9,46.3 | v50.08,18.42 50.08,3.22 50.06,3.2 | v31.4,41.4 30.42,41.4 30.02,41
  Top 0.813: 71.1,35.3 71.1,33.22 | 76.2,35.3 76.2,33.32 76.1,33.22 | 4.96,20.2 SV1.6 | v30.02,50.56 30.02,41 30.02,35.86 | v55.62,38.46 55.62,34.98 55.9,34.7 | v37.7,16.8 37.7,16.6 39.4,14.9 39.4,3.79 39.59,3.6 42.41,3.6 X6.1
  Top 1.016: 82.28,32.9 82.6,33.22 | 6,14.1 7.4,14.1 | 3.7,14.1 3.66,14.1 SV1.9 | 3.7,11.8 3.7,11.5 4.5,10.7 | 16.5,24.96 16.51,24.96 C2.- | 1.7,45.3 1.7,47.9 2.9,49.1 J1.2 | v2.4,54.7 2.3,55.3 2.3,55.05 | 1.71,55.05 1.69,55.05 1.69,55.02
  Top 1.27: 80.27,33.13 80.36,33.22 | SV1.9 2.42,15.28 | 8.2,14 8.4,13.8 8.4,11.74 8.33,11.67 | 5,10.3 6.3,10.3 7.1,10.3 9,12.2 9,18.6 12.8,22.4 12.7,22.4 | 12.4,50.2 12.5,50.2 12.65,50.35
  Top 1.422: X5.1 23.27,1.6 v19.2,1.6 v18,1.6 v16.8,1.6 | 23.2,2 23.2,3.2 | 15.6,2 v15.6,1.6 | v92.4,10.8 v92.4,9.6 v92.4,8.4 88.93,8.4 X8.1 | v29.2,35.6 v30.8,35.6 25.6,35.6 23.2,33.2 23.25,33.2 X1.1
  Top 1.93: 13.37,23.47 13.37,31.19 9.54,35.02 9.54,41.14 7.46,43.22 6.76,43.22 6.24,43.74 | 8.16,42.17 4.49,42.17 3.98,42.68 3.47,43.19 3.47,43.21 1.72,44.96 1.71,44.96 1.36,45.31 1.36,54.69 1.69,55.02 | 5.24,47.72 5.24,48.02 8.02,50.8 10.48,50.8 12.45,48.83 12.45,46.31 11.29,45.15 7.03,45.15 5.59,46.59 | 14.77,46.51 13.21,44.95 13.21,40.24 14.99,38.46 14.99,23.75 13.79,22.55 | 12.92,21.68 9.65,18.41 9.65,18.4 9.1,17.85 9.1,11.26 7.79,9.95 6.73,9.95 6.39,10.29 | 12.72,21.68 12.92,21.68 | 12.92,21.68 13.79,22.55 | 13.79,22.55 15.91,22.55 17.3,23.94 14.28,23.94 | 16.64,25.1 16.5,24.96 | 1.71,55.05 2.3,55.05 3.67,55.05
  Top 2.184: X1.1 X2.1 51.2,33.22 X3.1 71.1,33.22 76.1,33.22 77.4,33.22 80.36,33.22 82.6,33.22 X4.1 | 14.82,24.29 10.95,20.42 SV1.6 6.08,20.42 7.4,19.1 7.4,14.1 7.4,11.6 7.83,11.17
  Top 2.54: D2.A 5.08,49.48 J1.3 9.4,53.6 12.65,50.35 12.9,50.1 12.9,46.3 12.9,46 11.3,44.4 11.3,42.65 C1.- 14.82,39.03 14.82,24.29 C2.- | SV1.14 6.92,10.26 7.83,11.17 8.33,11.67 | 14,46.5 14.3,46.5 14.5,46.7 14.5,49.6 9,54.7 v2.4,54.7 | 1.8,54.7 v2.4,54.7 | v2.4,54.7 5.9,54.7 7.1,53.5 8,53.5 9.4,52.1 | 12.6,34.4 10.5,34.4 9.75,35.15 9,35.9 9,39.1 8.6,39.5 4.8,39.5 1.7,42.6 1.7,45.3 | 1.7,45.7 1.7,45.3 | 1.7,45.3 5.5,41.5 7.7,41.5 8.2,41 | 14.28,23.94 14.28,23.58 8.5,17.8 8.5,11.8 7.4,10.7 7.3,10.7 6.8,10.2 5.3,10.2 | 5,10.3 5.1,10.2 5.3,10.2 | 6.3,10.3 14,10.3 | 14,10.3 14.2,10.3 | 14.2,10.3 15.3,11.4 15.3,19 18,21.7 18,23.2 | 17.7,22.1 17.7,22.8 17.7,22.9 18,23.2 | 18,23.2 18,24.4 15,27.4 | 8.4,10.2 8.4,10.5 7.35,11.55 | 7.35,11.55 7.3,11.6 7.3,18.8 6.2,19.9 | 13.8,17.6 13.1,16.9 13.1,11.7 12.95,11.55 | 16.7,22.9 11,17.2 11,11.8 | 12.95,11.55 12.9,11.5 11.3,11.5 11,11.8 | 8.1,13.2 8.1,12.5 6.55,10.95 6,10.4 | 11,11.8 v13,11.8 | v13,11.8 14,11.8 14,10.3 | v10.4,11.8 11,11.8 | 5.9,20.2 4.96,20.2 | v13,11.8 12.95,11.8 12.95,11.55 | 7.4,11.6 7.35,11.6 7.35,11.55 | 5.3,10.2 5.4,10.1 14,10.1 14.2,10.3 | 23.2,33.3 22.7,33.8 22.7,34.4 23.4,35.1 68.6,35.1 69.8,33.9 | 23,33.2 23,34.3 23.4,34.7 55.9,34.7 68.4,34.7 68.7,34.7 69.5,33.9 | 12.4,50.2 6.5,50.2 6.5,50.5 | 22.8,3.6 8.4,3.6 8.4,2 15.6,2
  Top 3: 85.2,3.2 85.2,3.6 89.6,8 91.6,8 91.6,12 | 26,2 23.2,2 15.6,2
  Top 4.5: 22.4,3.2 23.2,3.2 50.06,3.2 85.2,3.2
  Bottom 0.254: IC3.3 10.65,32.21 10.65,34.6 10.65,36.05
  Bottom 0.305: IC1.15 53.67,24.98 56.27,27.57 IC1.10 | C7.2 59.85,26.15 | 22.12,2.74 23.2,2.74 23.2,2.7 | 58.52,27.57 56.8,27.57 56.8,27.6 | 88.7,27.7 88.8,27.8 89.9,27.8 v90.3,27.4 | v92.4,27.3 92.4,25.1 91.4,24.1 88.7,24.1 | T3.2 28.85,21.45 | X5.1 23.3,2.74 23.3,2.77
  Bottom 0.406: Q1.4 23.26,46.37 23.26,45.07 Q1.1 21.73,45.07 21.72,45.08 | Q2.4 43.25,46.37 43.25,45.07 Q2.1 40.95,45.07 41.72,45.08 | Q3.1 63.25,45.07 63.25,46.37 Q3.4 64.77,46.37 | Q5.4 23.26,15.89 23.26,14.59 Q5.1 21.73,14.59 | Q6.4 43.26,15.89 43.26,14.59 Q6.1 41.37,14.59 | Q4.1 83.25,45.07 83.25,46.37 Q4.4 84.78,46.37 | Q7.4 63.26,15.89 63.26,14.59 Q7.1 61.72,14.59 | Q8.1 83.26,14.59 83.26,15.89 Q8.4 84.77,15.89 84.78,15.9 | C8.2 78.95,26.65 77.72,27.89 IC2.9 77.72,28.32 77.7,28.3 | IC1.10 58.52,27.57 58.9,27.2 58.9,26.7 59.2,26.4 59.65,26.4 C7.2 | 56.8,27.6 56.1,27.6 | 5.02,10.2 5,10.2 4.96,10.2 SV1.14 | v13.2,38 v11.6,38 v14.8,38 v14.8,36.4 v13.2,36.4 | T2.2 38.9,20.5 37.7,19.3 v37.7,16.8 | 90.68,23.12 91,23.44 91.86,23.08 | v91.88,22.88 90.92,22.88 90.81,22.99 | T5.2 29.46,51.12 v30.02,50.56 | 28.85,21.45 27.9,22.4 27.9,23.6 27.1,24.4 20,24.4 v19,23.4
  Bottom 0.61: 56.1,27.6 54.4,27.6 53.7,28.3 53.7,31.1 52.2,32.6 52.2,34.5 v51.1,35.6 51.1,39 50.75,39.35 D4.1 | 77.7,28.3 77.7,28 79.3,26.4 80.95,26.4 82.87,24.48 88.6,24.48 88.7,24.58 | 3.7,13.7 3.7,11.8 | 8.1,14.1 6,14.1 3.7,14.1 3.7,11.52 SV1.14 | 8.1,14.1 v10.4,11.8 | 5.8,14.1 7.1,14.1 7.4,13.8 | 8.1,14.1 8.45,14.1 10.3,12.25 | 6.2,10.5 6.15,10.55 5.25,10.55 5,10.3 5.9,10.3 6,10.4 8,10.4 9,10.4 v10.4,11.8 | v10.4,11.8 8.8,11.8 8.1,12.5 9.7,7.7 v14.8,10.1 | 20.08,34.72 20.05,34.72 20.05,34.6 | 18.2,36.06 19,36.06 19,39.3 | 18.11,36.06 18.2,36.06 | 18.2,36.06 18.2,36.05 | 18.08,39.48 18.13,39.48 18.13,39.43 | v3.2,40.7 1.8,42.3 1.8,39.4 | 87.92,6.3 87.92,8.03 88.45,8.56 | 15.52,1.52 14.48,1.52 v14.4,1.6 v13.2,1.6 v12,1.6 v10.8,1.6 v9.6,1.6 | T1.2 51.28,20.05 | 51.28,20.05 51.21,20.05 50.08,18.92 v50.08,18.42 | C11.2 51.16,20.17 51.28,20.05 | C12.2 86.7,16.84 87.65,15.89 | T7.2 69.38,46.34 68.18,45.14 | D3.1 31.35,41.45 v31.4,41.4 | D5.1 60.79,35.7 X3.1 | D6.1 90.2,38.8 90.5,38.5 | D7.1 28.65,5.45 29.4,4.7 | D8.1 48.95,5.13 50.08,4 50.08,3.58 49.7,3.2 43.73,3.2 X6.1 | D9.1 68.65,2.99 68.4,2.74 | D10.1 78.95,4.69 80.9,2.74 | C14.2 78.04,50 79.64,51.6 | 34.9,10.4 34.9,8.1
  Bottom 0.813: 21.72,45.08 20.89,45.08 20.05,44.24 20.05,34.6 20.05,34.5 | 20.05,34.5 20.05,34.32 | 41.72,45.08 40.52,45.08 40.09,44.65 40.09,33.92 40.79,33.22 X2.1 | 64.77,46.37 66.95,46.37 | X3.1 67.07,33.22 v68.53,34.68 | 84.78,46.37 87.53,46.37 90.5,43.4 90.5,38.5 90.5,35.67 88.05,33.22 83.8,33.22 84.33,32.69 C5.2 | 21.73,14.59 20.12,14.59 19.43,13.9 19.43,3.77 20.46,2.74 22.12,2.74 | 41.37,14.59 40.43,14.59 39.54,13.7 39.54,3.65 40.45,2.74 X6.1 | 84.78,15.9 87.65,15.89 88.92,14.62 87.92,6.3 | 86.62,5.18 87.08,2.74 86.3,2.74 83.8,2.74 X8.1 | 68.18,45.14 68.53,44.79 | 61.72,14.59 60.02,14.59 59.22,13.79 59.22,4.03 60.51,2.74 X7.1 | 4.9,50.9 4.7,50.9 J1.2 | C3.2 18.2,36.05 18.5,36.05 20.05,34.5 | 11.1,37.1 10.7,37.1 10.5,36.9 | 88.63,17.33 88.7,17.26 | T6.2 49.08,48.84 55.62,42.3 v55.62,38.46 | T8.2 79.64,51.6 79.64,47.41 68.53,36.3
  Bottom 1.016: 66.95,46.37 68.18,45.14 | 68.53,44.79 68.53,36.3 v68.53,34.68 | C3.2 10.65,36.05 10.5,36.2 | IC3.5 7.1,39.4 | 7.1,39.4 8.8,41.1 | C4.2 8.43,11.13 7.5,10.2 | 3.7,11.8 3.7,11.5 5,10.2 | 2.4,15.3 2.5,15.3 3.7,14.1 | 6,14.1 6.8,14.1 8.5,12.4 | 7.1,39.4 7.1,43.8 3.7,47.2 | 6.2,44.2 4.4,44.2 J1.2 | 4.7,42.3 v3.2,40.7 J1.2 | J1.2 4.3,50.6 4.3,52.9 | C13.2 31.12,35.28 v30.8,35.6 | 91,38.5 91.1,38.6 91.1,43.7 89.95,44.85 C6.2 | SV2.5 33.63,4.17 33.7,4.1 34.5,4.1 | 34.5,4.1 41.91,4.1 X6.1 | SV2.1 33.63,11.67 34.9,10.4 | 34.9,8.1 34.9,8 34.5,7.6 34.5,4.1 | C15.2 32.65,6.85 32.9,6.6 32.9,4.7 | C16.2 38,4.8 37.9,4.7
  Bottom 1.27: 8.93,36.24 8.93,35.05 10.2,33.78 10.72,33.78 12.98,36.04 11.78,36.04 10.46,34.72 9.26,34.72 8.09,35.89 | 91,38.5 91,35.7 86.95,31.65
  Bottom 1.422: 15.52,1.52 16.8,1.52 16.8,2 16.4,2 15.6,2 v15.6,1.6
  Bottom 1.93: 18.15,39.18 18.15,39.41 | 18.15,39.41 18.13,39.43 18.08,39.48 | 18.08,39.48 14.75,42.81 | 15.28,39.48 18.08,39.48 | 18.15,39.41 19.61,37.95 19.61,37 20.85,35.76 30.92,35.76 32.82,33.86 31,33.86 30.38,34.48 20.32,34.48 20.08,34.72 | 6.9,10.31 6.9,10.99 8.16,12.25 10.3,12.25 13.96,12.25 21.51,4.7 29.4,4.7 32.9,4.7 37.9,4.7 85.41,4.7 88.4,7.69 87.5,5.03 85.39,1.52 15.52,1.52 6.93,9.91 7.96,9.91 8.81,10.76 13.65,10.76 20.21,4.2 15.79,4.2 10.39,9.6 12.7,9.6 17.03,5.27
  Bottom 2.184: 23.2,2.7 43.27,2.7 X6.1 | 22.12,2.74 X5.1 X6.1 | X6.1 X7.1 68.4,2.74 80.9,2.74 83.8,2.74 | X4.1 83.8,33.22 85.38,33.22 86.95,31.65 88.7,29.9 88.7,27.7 88.7,24.58 88.7,24.1 88.7,17.26 88.7,9.24 88.45,8.56 86.3,2.74 | C10.- 23.5,32.99 X1.1
  Bottom 2.54: J1.3 7.6,53.6 4.9,50.9 4.6,50.6 4.6,45.3 8.8,41.1 10.5,39.4 10.5,36.9 10.5,36.2 | X1.1 21.88,33.22 17.8,37.3 11.3,37.3 11.1,37.1 | 5.02,10.2 7.5,10.2 | 11.9,42.9 12.7,42.9 14.3,44.5 17.1,44.5 18.7,42.9 18.7,39.6 19,39.3 19,40.1 16.3,42.8 | 6.1,53.9 6.1,52.5 5.7,52.1 5.7,52 5.3,51.6 5.3,45.1 6.2,44.2 | 3.7,51.9 3.7,47.2 3.7,43.3 4.7,42.3 4.7,41.4 5.7,40.4 5.7,39.7 3.4,37.4 3.4,41.3 3.3,41.4 | 9,53.6 4.4,53.6 3.7,52.9 4.3,52.9 | 4.5,47.2 4.5,46.7 7.4,43.8 7.4,39.4 3.1,35.1 2.6,35.1 1.8,35.9 1.8,39.4 1.8,53.2 2.9,54.3 5.6,54.3 | 9,53.6 10.2,53.6 10.2,53.7 8.5,55.1 6.5,55.1 5.7,54.3 5.6,54.3 | 9,53.6 7.5,55.1 | 5.1,20.2 6.1,20.2 7.8,18.5 7.8,14.2 10.2,11.8 v10.4,11.8 10.4,11.7 7.4,11.7 | 9.4,12.9 12.9,12.9 14.1,11.7 13,11.7 v13,11.8 | 7.4,18.4 7.4,13.8 7.4,11.7 | 7.4,11.7 6.2,10.5 | 87,4.4 87,5.6 87.4,6 87.5,6 87.6,6.1 | 87.8,6.3 87.6,6.1 | 87.6,6.1 90.4,9.1 | 90.4,9.1 90.2,11.4 87.5,5.6 | 87.5,5.6 86.9,4.7 | 86.9,4.7 86.7,4.4 86.8,4.5 | 90.4,9.1 90.4,21.1 88.9,22.6 88.9,24.9 90.68,23.12 90.81,22.99 92,21.8 92,8.3 91.5,7.8 89.4,7.8 90,8.4 90.3,8.4 86.4,4.5 86.4,2.3 85.9,1.8 85.4,1.8 85.3,1.9 84.9,1.9 84,2.8 80.1,2.8 | 90.4,9.1 90.4,8.9 89.8,8.3 | 10.46,34.72 10.65,34.72 10.65,34.6 | 6.3,54.9 5.6,54.2 5.6,54.3 | 87.5,5.6 87.32,5.2 87.92,6.3 | 87.4,5.9 87.4,5.7 87.1,5.4 87.1,4.9 86.9,4.7 | 86.9,4.7 86.9,2.4 86.3,1.8 15.7,1.8 14,3.5 | 8,10.4 8,2 10,2 | 16.4,2 10,2 | 10,2 10,5.6 11.6,5.6 11.6,3.6 | 23.3,2.77 15.17,2.77 7.75,10.19 6.03,10.19 5.95,10.27
N$1
  Bottom 0.305: Q2.3 42.45,46.67
  Bottom 0.813: 42.45,46.67 42.45,47.4 X2.4
N$2
  Bottom 0.305: Q3.6 64.05,44.77
  Bottom 0.813: 64.05,44.77 64.05,44 X3.3
N$3
  Bottom 2.54: J1.1 13.58,47.5 D1.A
N$4
  Bottom 0.305: Q1.6 24.05,44.77
  Bottom 0.813: 24.05,44.77 24.05,44 X1.3
N$6
  Bottom 0.305: Q1.3 22.45,46.68
  Bottom 0.813: 22.45,46.68 22.45,47.4 X1.4
N$7
  Bottom 0.305: Q3.3 62.45,46.67
  Bottom 0.813: 62.45,46.67 62.45,47.4 X3.4
N$8
  Bottom 0.305: Q2.6 44.05,44.78
  Bottom 0.813: 44.05,44.78 44.05,44 X2.3
N$9
  Bottom 0.305: Q4.6 84.05,44.77
  Bottom 0.813: 84.05,44.77 84.05,44 X4.3
N$10  (via drill 0.6)
  Top 1.016: 10.72,26.68 10.72,27.31 v11.14,27.73 | v11.16,29.05 10.59,29.05 10.54,29.1 | v8.85,28.67 9.76,29.58 v9.76,29.96 9.76,29.94 10.3,29.4 | v10.56,26.56 10.68,26.56 10.72,26.6
  Top 1.93: 4.32,36.36 4.32,35.08 4.15,34.91 4.15,31.53 9.49,26.19 10.61,26.19 10.72,26.3 10.72,26.6 10.72,26.68 5.06,32.34
  Top 2.54: D2.C 5.08,34.62 7.7,32 | 7.7,32 10.3,29.4 10.54,29.16 10.54,29.1 10.54,26.58 v10.56,26.56 | 7.7,30.9 7.7,32
  Bottom 1.016: IC3.2 12.2,30.5 12.19,30.49
  Bottom 1.676: 12.19,30.49 12.19,27.06 12.69,26.56
  Bottom 2.54: v10.56,26.56 12.69,26.56 13.48,26.56 L1.2
N$11
  Bottom 0.305: Q4.3 82.45,46.68
  Bottom 0.813: 82.45,46.68 82.45,47.4 X4.4
N$12
  Bottom 0.305: Q5.3 22.45,16.19
  Bottom 0.813: 22.45,16.19 22.45,16.92 X5.4
N$13
  Bottom 0.305: Q5.6 24.05,14.29
  Bottom 0.813: 24.05,14.29 24.05,13.52 X5.3
N$14
  Bottom 0.305: Q6.6 44.05,14.29
  Bottom 0.813: 44.05,14.29 44.05,13.52 X6.3
N$15
  Bottom 0.305: Q6.3 42.45,16.19
  Bottom 0.813: 42.45,16.19 42.45,16.92 X6.4
N$16
  Bottom 0.305: Q7.6 64.05,14.29
  Bottom 0.813: 64.05,14.29 64.05,13.52 X7.3
N$17
  Bottom 0.305: Q7.3 62.45,16.19
  Bottom 0.813: 62.45,16.19 62.45,16.92 X7.4
N$18
  Bottom 0.305: Q8.6 84.05,14.29
  Bottom 0.813: 84.05,14.29 84.05,13.52 X8.3
N$19
  Bottom 0.305: Q8.3 82.45,16.19
  Bottom 0.813: 82.45,16.19 82.45,16.92 X8.4
N$20
  Bottom 0.305: Q6.2 41.86,15.24 40.3,16.8 40.3,18.6 41.1,19.4 46,19.4 47.1,20.5 47.1,25.4 47.8,26.1 47.8,27.6 49.08,28.88 IC1.21
N$21
  Bottom 0.305: IC1.22 48.92,29.52 47.2,27.8 47.2,26.3 46.6,25.7 46.6,25.5 46.6,20.8 45.9,20.1 40.8,20.1 39.6,18.9 39.6,15.3 38.5,14.2 29.1,14.2 27.7,12.8 D7.3
  Bottom 0.61: X5.2 24.84,7.74 25.9,8.8 27.6,8.8 D7.3
N$22
  Bottom 0.305: Q5.5 38.44,15.24 38.9,15.7 38.9,19.1 40.6,20.8 45.8,20.8 46,21 46,25.6 46,25.9 46.6,26.5 46.6,28.1 48.67,30.18 IC1.23
N$23
  Bottom 0.305: Q5.2 22.39,15.3 21.9,15.3 20.2,17 20.2,18.6 21.2,19.6 25.6,19.6 27.2,17.9 29.7,17.9 35,23.3 35,24.7 36.4,26.1 45.3,26.1 46,26.8 46,28.4 48.42,30.82 IC1.24
N$24
  Bottom 0.305: X1.2 35.28,38.22 37.4,36.1 37.4,32.5 40.2,29.7 46,29.7 47.77,31.48 IC1.25
  Bottom 0.61: X1.2 23.52,38.22 D3.3
N$25
  Bottom 0.305: Q1.5 31.98,45.72 38.2,39.5 38.2,32.9 40.6,30.5 45.6,30.5 47.23,32.12 IC1.26
N$26
  Bottom 0.305: IC1.27 46.77,32.77 45.3,31.3 40.9,31.3 39,33.2 39,39.8 28.9,49.9 21.3,49.9 20.5,49.1 20.5,47 21.5,46 21.8,46 22.08,45.72 Q1.2
N$27
  Bottom 0.305: IC1.28 48.06,33.42 X2.2
  Bottom 0.61: D4.3 43.45,38.4 X2.2
N$28
  Bottom 0.305: Q2.5 49.78,45.72 53.6,41.9 53.6,32.5 55.27,30.82 IC1.5
N$29
  Bottom 0.305: Q2.2 42.18,45.72 42,45.9 41.6,45.9 40.2,47.3 40.2,49.4 40.9,50.1 45.4,50.1 46.4,49.1 46.4,47.2 47.2,46.4 50,46.4 54.3,42.1 54.3,32.8 55.62,31.48 IC1.4
N$30
  Bottom 0.305: IC1.1 57.6,33.45 57.6,36.8 58.1,37.3 59,37.3 D5.3
  Bottom 0.61: X3.2 59.92,38.22 D5.3
N$31
  Bottom 0.305: IC1.2 56.23,32.77 55.7,33.3 55.7,35.9 59.2,39.4 60.2,39.4 61.2,40.4 65.2,40.4 66.6,41.8 66.6,43.7 64.8,45.5 64.6,45.5 64.38,45.72 Q3.5
N$32
  Bottom 0.305: IC1.3 55.98,32.12 55,33.1 55,36.3 60.1,41.4 60.1,44.2 61.62,45.72 Q3.2
N$33
  Bottom 0.305: IC1.6 58.98,30.18 60,31.2 66.6,31.2 81.12,45.72 Q4.2
N$34
  Bottom 0.305: IC1.7 59.33,29.52 60.3,30.5 66.9,30.5 77.7,41.3 85.3,41.3 86.3,42.3 86.3,44.3 85.1,45.5 84.6,45.5 84.38,45.72 Q4.5
N$35
  Bottom 0.305: IC1.8 59.67,28.88 60.6,29.8 67.2,29.8 75.62,38.22 X4.2
  Bottom 0.61: D6.3 86.6,41 85.6,40 85.05,40 X4.2
N$36
  Bottom 0.305: 64.14,7.74 67.4,11 67.4,16.7 68.7,18 73.5,18 75.77,20.27 IC2.15
  Bottom 0.61: X7.2 64.14,7.74 65.5,9.1 D9.3
N$37
  Bottom 0.305: Q7.5 64.94,15.24 68.4,18.7 73.4,18.7 75.11,20.41 IC2.16
N$38
  Bottom 0.305: IC2.17 74.47,20.57 73.3,19.4 61.1,19.4 60.2,18.5 60.2,16.8 61.3,15.7 61.6,15.7 61.9,15.4 62,15.4 62.16,15.24 Q7.2
N$39
  Bottom 0.305: 44.84,7.74 46.7,9.6 46.7,12.9 49.3,15.5 57.5,15.5 59.3,17.3 59.3,18.6 60.8,20.1 73.2,20.1 73.81,20.71 IC2.18
  Bottom 0.61: X6.2 44.84,7.74 46.4,9.3 D8.3
N$40
  Bottom 0.305: IC2.19 73.17,21.07 72.9,20.8 60.5,20.8 58.6,18.9 58.6,17.7 57.3,16.4 45.84,16.4 44.68,15.24 Q6.5
N$41
  Bottom 0.305: IC2.14 76.42,18.09 79.5,15 79.5,9.2 80.96,7.74
  Bottom 0.61: X8.2 80.96,7.74 79.6,9.1 D10.3
N$42
  Bottom 0.305: IC2.13 77.06,18.43 80.2,15.3 80.2,11.9 81.5,10.6 85.3,10.6 86.4,11.7 86.4,13.7 85.1,15 84.6,15 84.36,15.24 Q8.5
N$43
  Bottom 0.305: IC2.12 77.72,18.79 81.26,15.24 Q8.2
N$44
  Bottom 2.184: 83.5,2.8 83.5,2.7
N$45
  Bottom 2.184: 83.3,2.7 86.2,2.7 87.3,5.1
N$46  (via drill 0.6)
  Top 0.305: U1.7 71.97,47.33 68.9,50.4 46.6,50.4 45.8,51.2 33.24,51.2 31.52,52.92 v31.52,54.12
  Bottom 0.305: T5.1 31.49,54.09 v31.52,54.12 32.06,53.58 R11.1
N$47  (via drill 0.6)
  Top 0.305: U1.6 72.62,47.77 69.1,51.3 53.6,51.3 51.22,53.68 v51.22,54.2
  Bottom 0.305: T6.1 51.19,54.17 v51.22,54.2 51.64,53.78 R12.1
N$48  (via drill 0.6)
  Top 0.305: U1.5 73.28,48.33 72.68,48.92 72.68,52.62 v72.68,54.78
  Bottom 0.305: R13.1 71.14,54.17 T7.1 72.07,54.17 v72.68,54.78
N$49  (via drill 0.6)
  Top 0.305: U1.4 73.92,47.62 77,50.7 v77,54.7
  Bottom 0.305: R14.1 76.51,54.21 v77,54.7 77.51,54.19 T8.1
N$50  (via drill 0.6)
  Top 0.305: U1.9 71.22,30.1 71,30.1 70.8,30.3 68.8,30.3 68.3,29.8 68.3,26.7 66.5,24.9 61.1,24.9 v58.6,22.4
  Bottom 0.305: v58.6,22.4 57.3,22.4 55.8,20.9 55.8,18.15 T1.1
  Bottom 0.61: R7.1 54.21,17.66 T1.1
N$51  (via drill 0.6)
  Top 0.305: U1.10 71.97,30.73 71.7,31 68.6,31 67.7,30.1 67.7,26.9 66.4,25.6 49.4,25.6 48.9,25.1 v40.6,25.1 | R8.1 34.45,22.65 v36.9,25.1
  Bottom 0.305: v40.6,25.1 39.55,25.1 T2.1 38.25,25.1 v36.9,25.1
N$52  (via drill 0.6)
  Top 0.305: U1.11 72.62,31.27 72.3,31.6 68.2,31.6 67.1,30.5 67.1,27.2 66,26.1 36.3,26.1 v33.8,23.6
  Bottom 0.305: v33.8,23.6 33.8,23.1 32.9,22.2 31.85,22.2 R9.1 31.15,22.25 30.1,23.3 29.05,23.3 T3.1
N$53
  Top 0.254: 76.7,30.8 78.1,30.8
  Top 0.305: U1.12 73.28,31.07 73.7,31.5 76,31.5 76.7,30.8 | 78.1,30.8 78.68,30.8 79.1,30.38 79.1,29.8 80,28.9 80,26.8 80.6,26.2 80.6,21.7 81.36,20.94 89.15,20.94 T4.1 89.67,21.26 R10.1
N$54
  Top 2.54: 7.9,30.6 7.9,31.1 6.1,32.9 6.1,33 5.9,33.2 5.8,33.2
N$55
  Top 0.406: 8.1,31.2 7.3,31.2 7.3,31
N$56  (via drill 0.6)
  Top 0.305: v77.6,26.4 77.6,25.9 78.6,24.9 78.6,21.6 77.4,20.4 | 77.4,20.4 76.7,19.7 54.3,19.7 53.8,19.2 45.4,19.2 45.3,19.3 37.1,19.3 v36.8,19 | R16.1 77.25,20.55 77.4,20.4 | v48,22.4 47.3,22.4 45.3,24.4 41.4,24.4 38.9,21.9 37.2,21.9 v37.1,21.8 37.1,21.6 36.5,21 20.2,21 17.8,18.6 17.8,7.7 17.1,7 11.45,7 R15.2
  Bottom 0.305: IC2.8 77.06,27.64 77.3,27.4 77.3,26.7 v77.6,26.4 | v37.1,21.8 37.1,19.3 v36.8,19 | IC1.20 49.73,28.23 49.7,28.2 49.2,28.2 48.3,27.3 48.3,22.7 v48,22.4
N$57
  Top 2.54: 7.1,31.4 6.6,31.9 6.6,32.3 6.1,32.8 6.1,33.1 5.8,33.4 5.8,36.1 5.5,36.4 2.4,36.4 2.2,36.2 2.2,33.9 4.5,31.6
N$58
  Top 0.61: 34.9,10.4 34.9,8.1
  Top 1.016: 33.6,11.8 33.6,11.7 34.9,10.4 | 34.9,8.1 34.9,8 34.4,7.5 34.4,7.4 34.5,7.3 34.5,4.4
N$59
  Bottom 2.54: 89.1,11.9 89.1,11.4 87.3,9.6 87.3,6 87.1,5.8
N$60
  Top 1.93: 13.23,41.61 13.23,41.16
N$61
  Bottom 0.406: T1.3 57.3,19.1 60,21.8 62.33,21.8 X7.5
N$62
  Bottom 0.406: T2.3 42.51,23.5 X6.5
N$63
  Bottom 0.406: T3.3 23.61,22.4 X5.5
N$64
  Bottom 1.93: 8.15,48.09 8.15,49.71 9.35,50.91 11.26,50.91 13.01,52.66 18.5,52.66 18.83,52.33 18.83,48.09 18,47.26 11.68,47.26 9.73,49.21 12.14,49.21 12.35,49.42 12.35,49.96 13.76,51.37 14.76,51.37 14.76,50.59 13.55,49.38 15.71,49.38 16.71,48.38 16.88,48.38 17.42,48.92
N$65
  Top 0.406: X8.5 84.15,21.86 87.7,21.86 89.26,23.42 90.38,23.42 T4.3
N$66
  Bottom 0.406: T5.3 23.35,53.14 X1.5
N$67
  Bottom 0.406: T6.3 X2.5
N$68
  Bottom 1.93: 10.74,26.94 10.58,26.94 8.89,28.63 8.91,28.63 9.86,29.58 16.3,29.58 16.51,29.37 16.51,26.1 16.44,26.03 10.64,26.03 10.34,26.33
N$69
  Bottom 0.406: T7.3 X3.5
N$70
  Bottom 0.406: T8.3 83.25,53.24 X4.5
N$71
  Bottom 1.27: 11,29.61 11,29.8 12.02,30.82 12.2,30.82 13.07,29.95
N$72
  Top 0.305: R15.1 4.98,7.7 SV1.16
N$74
  Top 1.016: 33.6,6.8 33.6,4.4
N$99
  Top 2.54: 17.4,53.1 17.4,51.5 | 17.4,51.5 17.4,43.6 17.9,43.1 17.8,43.1 17.5,42.8 17.5,41 | 18.9,39.6 17.5,41 | 17.5,41 15.9,42.6 15.9,43.5 18.1,45.7 | 13.1,56.9 13.1,55.8 17.4,51.5
N$107
  Top 2.184: 17.9,41.8 17.9,28.9 19,27.8 19,32 19.1,32.1 19.1,32 20.9,30.2 27.4,30.2 29,28.6 20.9,28.6 20.6,28.9 20.2,28.9 19.1,27.8 20,26.9 30,26.9 30.5,27.4
SCL  (via drill 0.6)
  Top 0.305: 74.6,25.31 74.6,23.6 73.8,22.8 73,22.8 72,23.8 68.7,23.8 68.35,23.45 | 74.6,25.31 74.6,29.55 U1.14 | 51.35,23.55 52.1,24.3 54.9,24.3 58.2,21 67.4,21 68,21.6 68,23.1 68.35,23.45 | v50.5,24.1 50.8,24.1 51.35,23.55 | v67.8,24.7 67.8,24 68.35,23.45 | R1.1 74.59,25.3 74.6,25.31 | SV1.5 1.73,20.42 1.12,19.81 1.12,6.78 1.7,6.2 17.3,6.2 18.5,7.4 18.5,18.4 20.5,20.4 33.5,20.4 | 33.5,20.4 50.5,20.4 51.3,21.2 51.3,23.5 51.35,23.55 | SV2.2 36.64,11.84 37.4,12.6 37.4,13.4 33.7,17.1 v33.7,17.5 | v33.4,19.5 33.4,20.3 33.5,20.4
  Bottom 0.254: 54,24.3 50.7,24.3 v50.5,24.1
  Bottom 0.305: IC1.12 55.98,26.27 54,24.3 | v67.8,24.7 71.8,28.7 72.3,28.7 72.52,28.91 IC2.1 | v33.7,17.5 33.7,19.2 v33.4,19.5
SDA  (via drill 0.6)
  Top 0.305: 69.2,20.3 73.1,20.3 75.22,22.43 75.22,23.84 | 69.2,20.3 53.9,20.3 | U1.15 75.22,23.84 | v53.9,23.3 53.9,20.3 | v69.1,22.7 69.1,20.4 69.2,20.3 | R2.1 75.22,23.84 | 53.9,20.3 53.44,19.84 35.44,19.84 34.2,18.6 34,18.6 | SV1.3 1.91,22.96 0.54,21.59 0.54,6.36 1.4,5.5 17.6,5.5 19.2,7.1 19.2,18.2 20.7,19.7 31,19.7 32.1,18.6 34,18.6 | SV2.6 37.26,6.76 38.3,7.8 38.3,14.3 34,18.6
  Bottom 0.305: IC1.13 56.23,25.62 v53.9,23.3 | IC2.2 73.17,28.66 72.4,27.9 71.9,27.9 69.1,25.1 v69.1,22.7
(copper drawn outside any net)
  shapes: Bottom area x1, Top area x5

### Text on the board
tPlace: +12V | LED | RST | CH0 | CH1 | CH2 | CH3 | SET | STA | GND | CH4 | CH5 | CH6 | CH7
tNames: A1 | A0 | 1 | 0